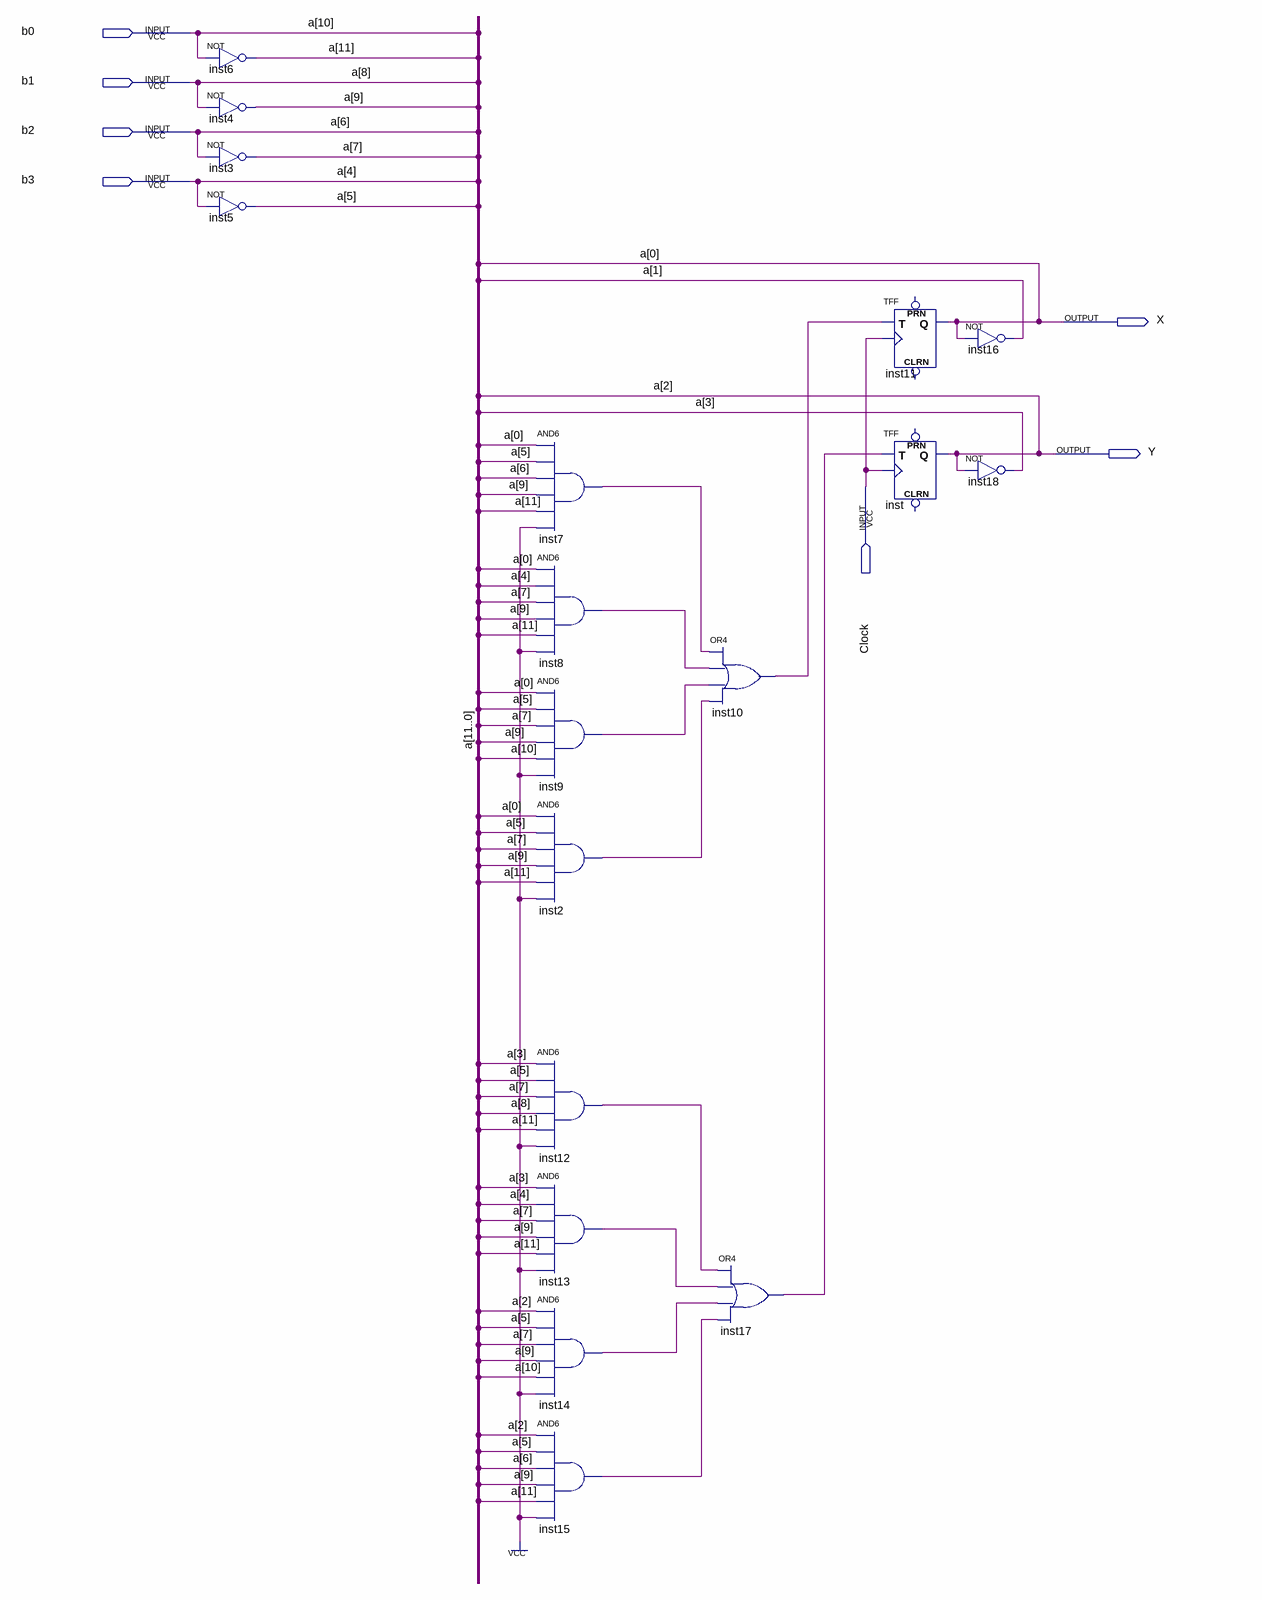
[diagram p0: schematic sheet]
// Quartus schematic StateHolder.bdf as structural Verilog: 18 symbols, 7 pins
module StateHolder (
  input  b0,
  input  b1,
  input  b2,
  input  b3,
  input  Clock,
  output X,
  output Y
);

  wire inst2_out, inst7_out, inst8_out, inst9_out, inst10_out, inst12_out, inst13_out, inst14_out,
       inst15_out, inst17_out;
  wire [11:1] a;

  not inst6 (a[11], b0);
  not inst4 (a[9], b1);
  not inst3 (a[7], b2);
  not inst5 (a[5], b3);
  and inst7 (inst7_out, X, a[5], b2, a[9], a[11], 1'b1);
  and inst8 (inst8_out, X, b3, a[7], a[9], a[11], 1'b1);
  and inst9 (inst9_out, X, a[5], a[7], a[9], b0, 1'b1);
  and inst2 (inst2_out, X, a[5], a[7], a[9], a[11], 1'b1);
  and inst12 (inst12_out, a[3], a[5], a[7], b1, a[11], 1'b1);
  and inst13 (inst13_out, a[3], b3, a[7], a[9], a[11], 1'b1);
  and inst14 (inst14_out, Y, a[5], a[7], a[9], b0, 1'b1);
  and inst15 (inst15_out, Y, a[5], b2, a[9], a[11], 1'b1);
  or inst10 (inst10_out, inst7_out, inst8_out, inst9_out, inst2_out);
  or inst17 (inst17_out, inst12_out, inst13_out, inst14_out, inst15_out);
  TFF inst11 (.T(inst10_out), .CLK(Clock), .Q(X));  // open: PRN, CLRN
  TFF inst (.T(inst17_out), .CLK(Clock), .Q(Y));  // open: PRN, CLRN
  not inst16 (a[1], X);
  not inst18 (a[3], Y);

  // Other names for the same wires on the sheet: a (some bits) = {b0, b1, b2, b3, Y, X}
endmodule
